# EAGLE design dxlboard (EAGLE 6.1)
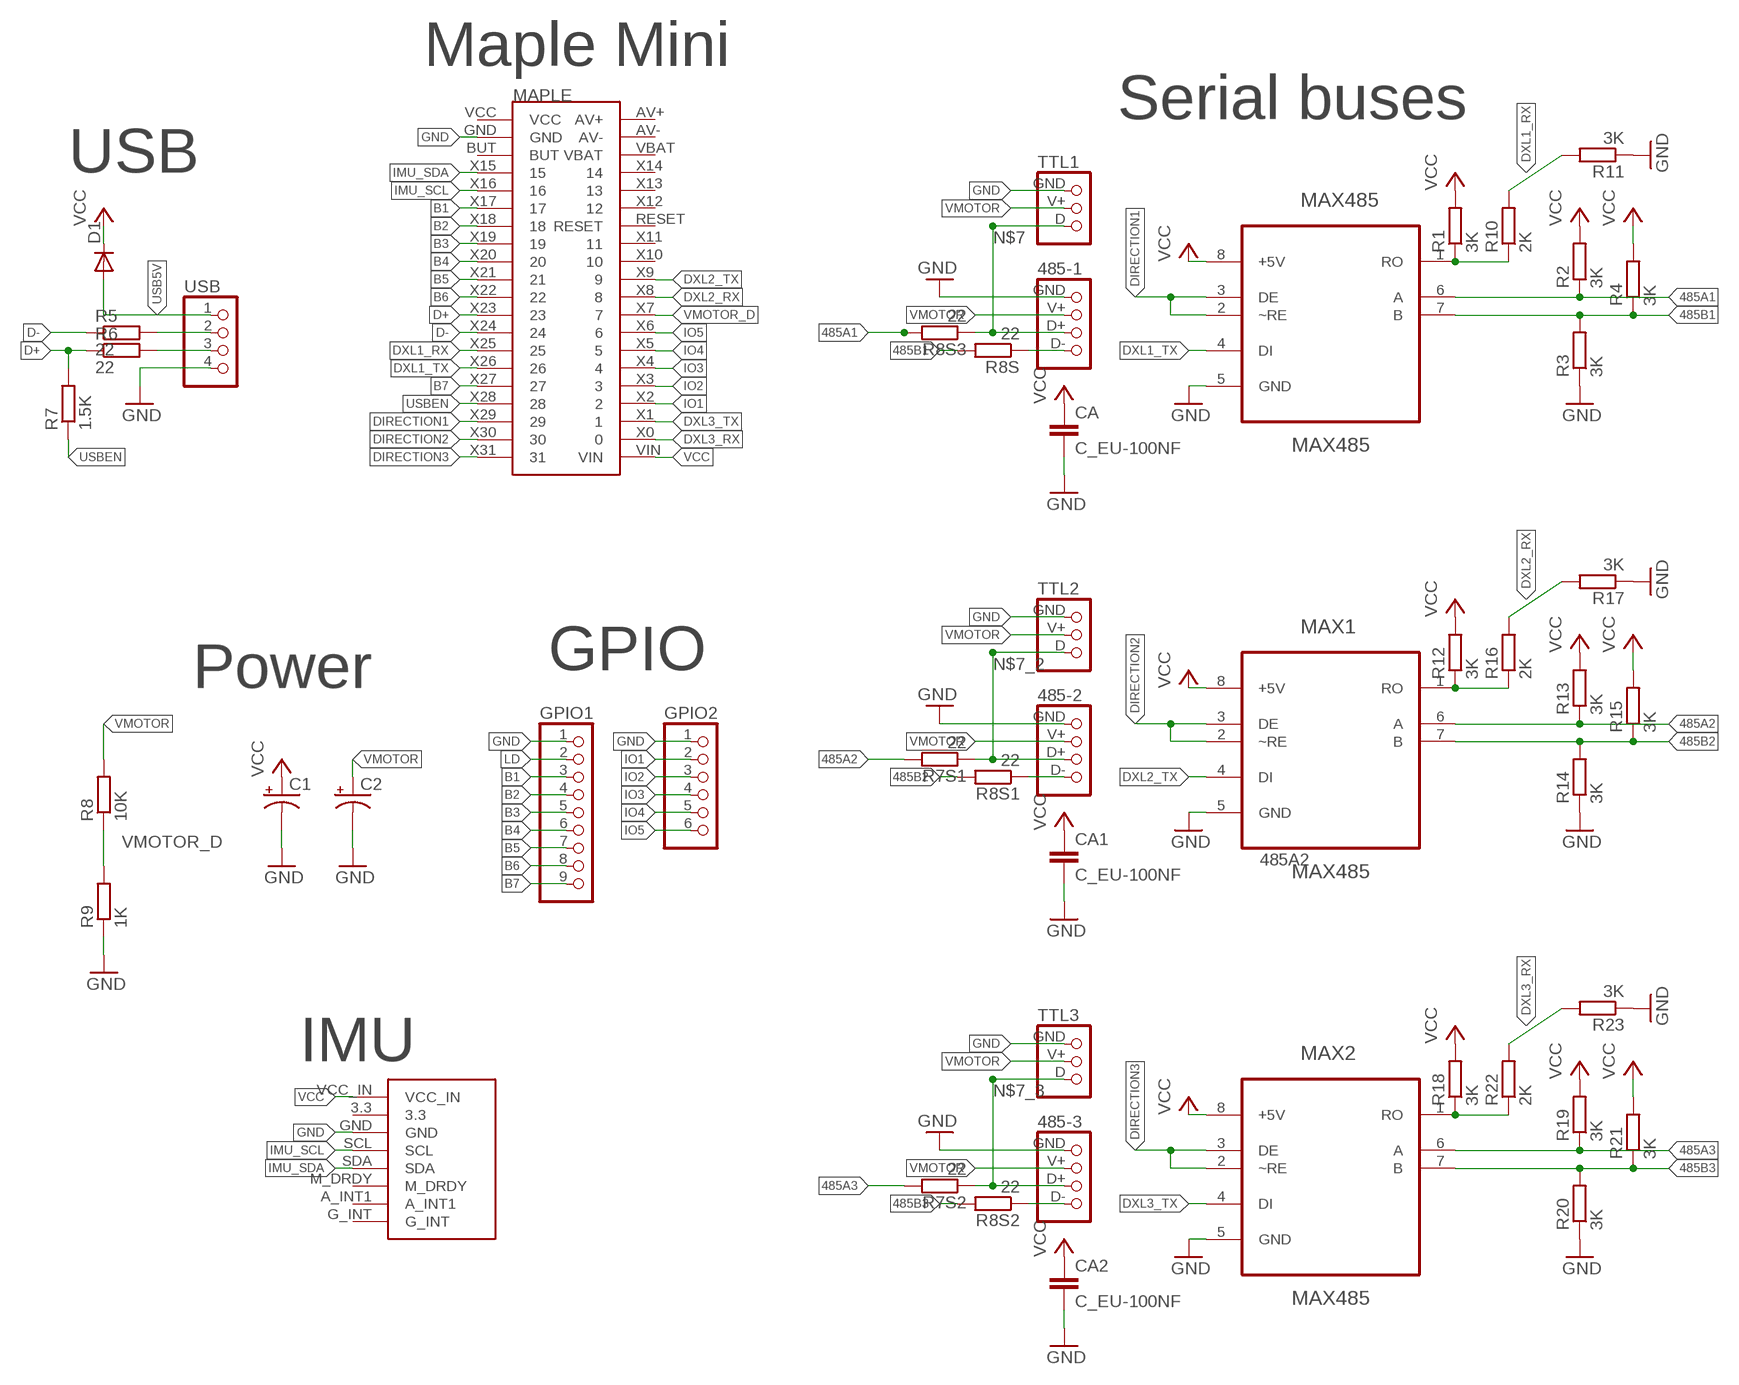
[diagram p0: schematic, sheet 1]

## Parts
485-1  CONNEC_1X04_485  [CONNEC_485]
485-2  CONNEC_1X04_485  [CONNEC_485]
485-3  CONNEC_1X04_485  [CONNEC_485]
C1  CAP_POLPTH2  [CPOL-RADIAL-10UF-25V]
C2  CAP_POLPTH2  [CPOL-RADIAL-10UF-25V]
CA  C_EU-100NF  [C0805]
CA1  C_EU-100NF  [C0805]
CA2  C_EU-100NF  [C0805]
D1  DIODESOD  [SOD-323]
GPIO1  CONNEC_1X09  [CONNEC_1X09]
GPIO2  CONNEC_1X06  [CONNEC_1X06]
MAPLE  MAPLE_MINI  [CONNEC_2X20]
MAX1  MAX485  [SO8]
MAX2  MAX485  [SO8]
MAX485  MAX485  [SO8]
R1  3K  RESISTANCE-R0805  [R0805]
R2  3K  RESISTANCE-R0805  [R0805]
R3  3K  RESISTANCE-R0805  [R0805]
R4  3K  RESISTANCE-R0805  [R0805]
R5  22  RESISTANCE-R0805  [R0805]
R6  22  RESISTANCE-R0805  [R0805]
R7  1.5K  RESISTANCE-R0805  [R0805]
R7S1  22  RESISTANCE-R0805  [R0805]
R7S2  22  RESISTANCE-R0805  [R0805]
R8  10K  RESISTANCE-R0805  [R0805]
R8S  22  RESISTANCE-R0805  [R0805]
R8S1  22  RESISTANCE-R0805  [R0805]
R8S2  22  RESISTANCE-R0805  [R0805]
R8S3  22  RESISTANCE-R0805  [R0805]
R9  1K  RESISTANCE-R0805  [R0805]
R10  2K  RESISTANCE-R0805  [R0805]
R11  3K  RESISTANCE-R0805  [R0805]
R12  3K  RESISTANCE-R0805  [R0805]
R13  3K  RESISTANCE-R0805  [R0805]
R14  3K  RESISTANCE-R0805  [R0805]
R15  3K  RESISTANCE-R0805  [R0805]
R16  2K  RESISTANCE-R0805  [R0805]
R17  3K  RESISTANCE-R0805  [R0805]
R18  3K  RESISTANCE-R0805  [R0805]
R19  3K  RESISTANCE-R0805  [R0805]
R20  3K  RESISTANCE-R0805  [R0805]
R21  3K  RESISTANCE-R0805  [R0805]
R22  2K  RESISTANCE-R0805  [R0805]
R23  3K  RESISTANCE-R0805  [R0805]
TTL1  CONNEC_1X03_TTL  [CONNEC_TTL]
TTL2  CONNEC_1X03_TTL  [CONNEC_TTL]
TTL3  CONNEC_1X03_TTL  [CONNEC_TTL]
U$6  GY-85  [GY-85]
USB  CONNEC_1X04  [CONNEC_1X04]

## Nets
485A1: MAX485.6(A) R2.1 R8S3.2
485A2: MAX1.6(A) R7S1.2 R13.1
485A3: MAX2.6(A) R7S2.2 R19.1
485B1: MAX485.7(B) R3.2 R4.1 R8S.2
485B2: MAX1.7(B) R8S1.2 R14.2 R15.1
485B3: MAX2.7(B) R8S2.2 R20.2 R21.1
B1: GPIO1.3 MAPLE.X17
B2: GPIO1.4 MAPLE.X18
B3: GPIO1.5 MAPLE.X19
B4: GPIO1.6 MAPLE.X20
B5: GPIO1.7 MAPLE.X21
B6: GPIO1.8 MAPLE.X22
B7: GPIO1.9 MAPLE.X27
D+: MAPLE.X23 R6.1 R7.2
D-: MAPLE.X24 R5.1
DIRECTION1: MAPLE.X29 MAX485.2(~RE) MAX485.3(DE)
DIRECTION2: MAPLE.X30 MAX1.2(~RE) MAX1.3(DE)
DIRECTION3: MAPLE.X31 MAX2.2(~RE) MAX2.3(DE)
DXL1_RX: MAPLE.X25 R10.2 R11.2
DXL1_TX: MAPLE.X26 MAX485.4(DI)
DXL2_RX: MAPLE.X8 R16.2 R17.2
DXL2_TX: MAPLE.X9 MAX1.4(DI)
DXL3_RX: MAPLE.X0 R22.2 R23.2
DXL3_TX: MAPLE.X1 MAX2.4(DI)
DXL_1: MAX1.1(RO) R12.1 R16.1
DXL_2: MAX2.1(RO) R18.1 R22.1
DXL_485: MAX485.1(RO) R1.1 R10.1
GND [alime]: 485-1.GND 485-2.GND 485-3.GND C1.2(-) C2.2(-) CA1.2 CA2.2 CA.2 GPIO1.1 GPIO2.1 MAPLE.GND MAX1.5(GND) MAX2.5(GND) MAX485.5(GND) R3.1 R9.1 R11.1 R14.1 R17.1 R20.1 R23.1 TTL1.GND TTL2.GND TTL3.GND U$6.GND USB.4
IMU_SCL: MAPLE.X16 U$6.SCL
IMU_SDA: MAPLE.X15 U$6.SDA
IO1: GPIO2.2 MAPLE.X2
IO2: GPIO2.3 MAPLE.X3
IO3: GPIO2.4 MAPLE.X4
IO4: GPIO2.5 MAPLE.X5
IO5: GPIO2.6 MAPLE.X6
LD: GPIO1.2
N$1: 485-2.D- R8S1.1
N$2: R6.2 USB.3
N$3: 485-3.D- R8S2.1
N$5: 485-1.D- R8S.1
N$6: R5.2 USB.2
N$7: 485-1.D+ R8S3.1 TTL1.D
N$7_2: 485-2.D+ R7S1.1 TTL2.D
N$7_3: 485-3.D+ R7S2.1 TTL3.D
USB5V: D1.2(A) USB.1
USBEN: MAPLE.X28 R7.1
VCC: C1.1(+) CA1.1 CA2.1 CA.1 D1.1(C) MAPLE.VIN MAX1.8(+5V) MAX2.8(+5V) MAX485.8(+5V) R1.2 R2.2 R4.2 R12.2 R13.2 R15.2 R18.2 R19.2 R21.2 U$6.VCC_IN
VMOTOR [alime]: 485-1.V+ 485-2.V+ 485-3.V+ C2.1(+) R8.2 TTL1.V+ TTL2.V+ TTL3.V+
VMOTOR_D: MAPLE.X7 R8.1 R9.2
Unconnected: MAPLE.AV+ MAPLE.AV- MAPLE.BUT MAPLE.RESET MAPLE.VBAT MAPLE.VCC MAPLE.X10 MAPLE.X11 MAPLE.X12 MAPLE.X13 MAPLE.X14 U$6.3.3 U$6.A_INT1 U$6.G_INT U$6.M_DRDY

## Notes on the sheet
- Maple Mini
- Serial buses
- USB
- Power | GPIO
- IMU

## Library data of the parts
485-1-485-3 = rhoban:CONNEC_1X04; FARNELL: 1104204
C1 C2 = SparkFun-Passives:CAP_POL: Capacitor Polarized These are standard SMD and PTH capacitors. Normally 10uF, 47uF, and 100uF in electrolytic and tantalum varieties. Always verify the external diameter of the through hole cap, it varies with capacity, voltage, and manufacturer. The EIA devices should be standard.; FARNELL: 1144619
CA CA1 CA2 = rhoban:C_EU: non polarised condo; DATASHEET: condo100nF.pdf; FARNELL: 2688486RL; FARNELL_LINK: http://fr.farnell.com/kemet/c0805c104j5ractu/condensateur-100nf-50v-x7r-0805/dp/1414663RL
D1 = SparkFun-DiscreteSemi:DIODE: Diode These are standard reverse protection diodes and small signal diodes. SMA package can handle up to about 1A. SOD-323 can handle about 200mA. What the SOD-323 package when ordering, there are some mfgs out there that are 5-pin packages.; FARNELL: 8737843RL
GPIO1 = rhoban:CONNEC_1X09; FARNELL: -
GPIO2 = rhoban:CONNEC_1X06; FARNELL: -
MAPLE = rhoban:MAPLE_MINI; FARNELL: 1593469,1593469
MAX1 MAX2 MAX485 = rhoban:MAX485; DATASHEET: max485.pdf; DESCRIPTION: ±15kV ESD-Protected, Slew-Rate-Limited, Low-Power, RS-485/RS-422 Transceivers; FARNELL: 1564306; FARNELL_LINK: http://fr.farnell.com/maxim-integrated-products/max485eesa/transceiver-rs-485-422-cms/dp/1379973?Ntt=1379973; MPN: MAX485EESA+; OC_FARNELL: 1379973; OC_NEWARK: 68K4798; PACKAGE: SOIC-8; SUPPLIER: Maxim
R1-R4 R11-R15 R17-R21 R23 = rhoban:RESISTANCE: RESISTOR, European symbol; FARNELL: 2074431
R5 R6 R7S1 R7S2 R8S R8S1-R8S3 = rhoban:RESISTANCE: RESISTOR, European symbol; FARNELL: 2446926
R7 = rhoban:RESISTANCE: RESISTOR, European symbol; FARNELL: 2447592
R8 = rhoban:RESISTANCE: RESISTOR, European symbol; FARNELL: 2074334RL
R9 = rhoban:RESISTANCE: RESISTOR, European symbol; FARNELL: 2074332RL
R10 R16 R22 = rhoban:RESISTANCE: RESISTOR, European symbol; FARNELL: 2447622
TTL1-TTL3 = rhoban:CONNEC_1X03; FARNELL: 9979620
U$6 = rhoban:GY-85; FARNELL: 1593463
USB = rhoban:CONNEC_1X04; FARNELL: -

## Net classes
1 alime: width 0.762 mm, drill 0.254 mm

## Board
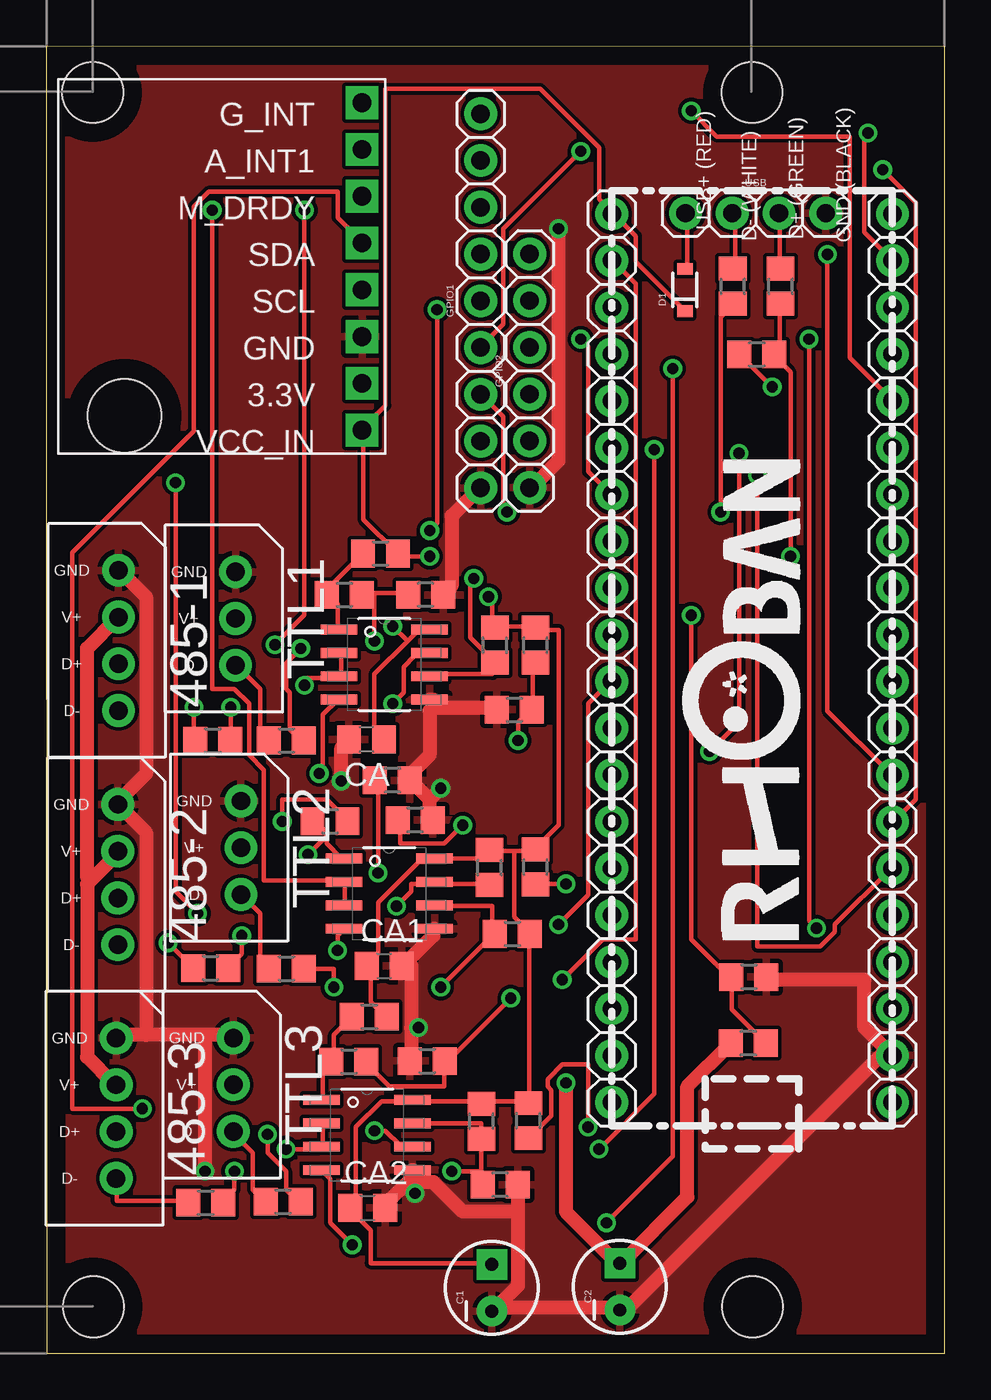
[diagram p1: board, top side]
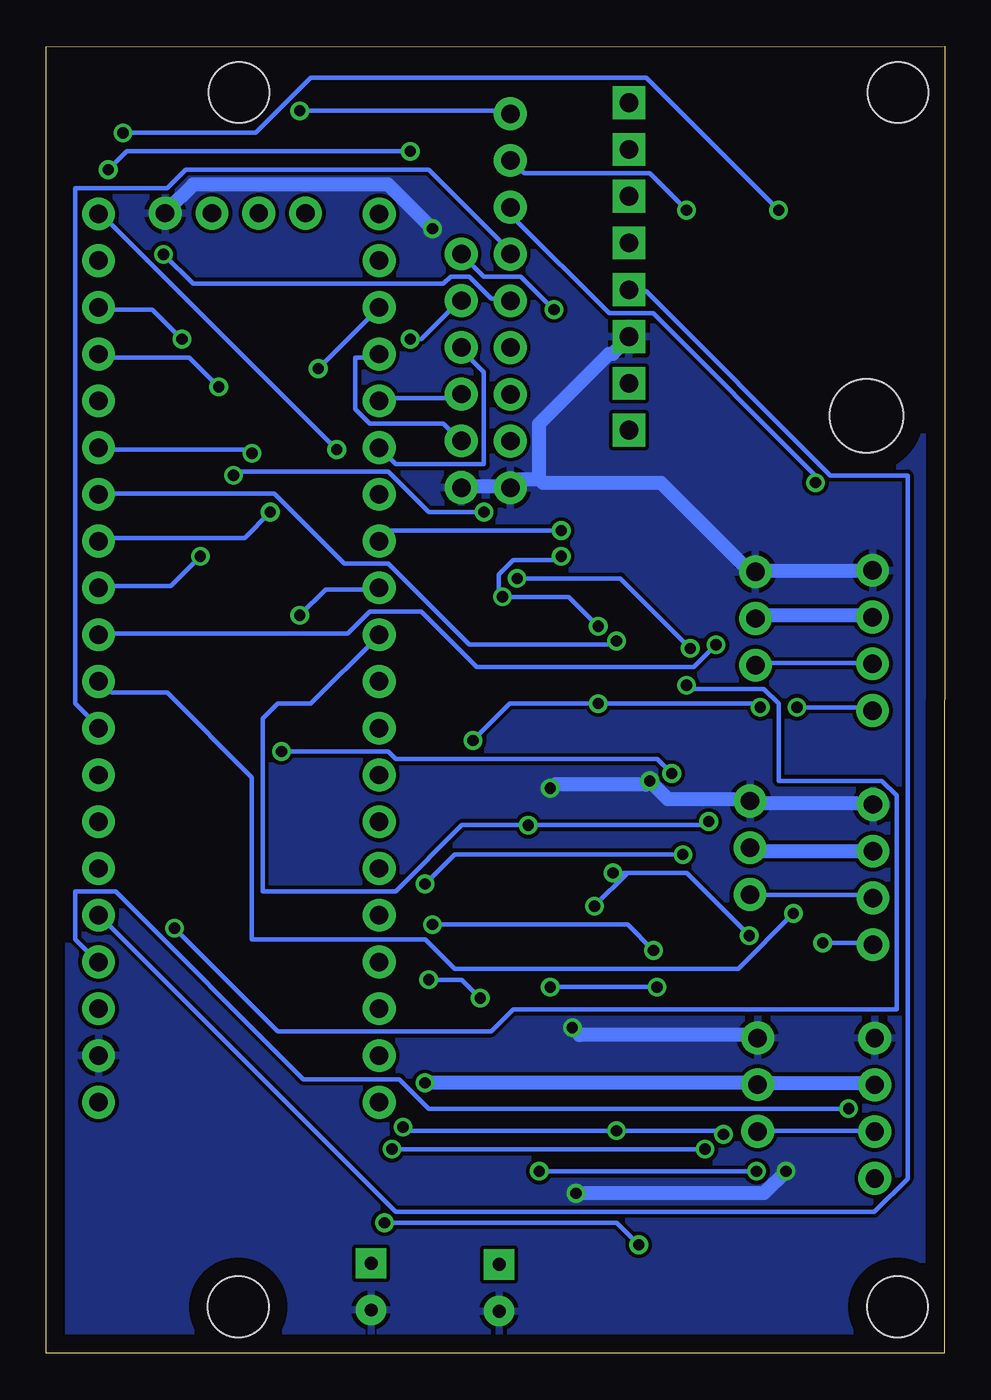
[diagram p2: board, bottom side, seen from below]

Size 48.81 x 71.02 mm. Coordinates in mm from the lower left corner, seen from the top.
Outline: 0.03,0 48.8,0 48.81,70.99 0,71.02 0.03,0
Copper layers (1*16): Top 0.035mm / dielectric 1.5mm / Bottom 0.035mm
Design rules: minimum track width 10mil, minimum drill 24mil, track to track 8mil, track to pad 8mil, pad to pad 8mil, via to via 8mil, smd to smd 8mil, copper to edge 40mil, drill to drill 8mil, minimum pad ring 8mil, minimum via ring 8mil, stop-mask expansion 4mil, vias tented up to drill 0mil, thermal gap 10mil

### Footprints (pad centres in the part's own frame; a part is rotated, then mirrored left to right if it is on the bottom)
CONNEC_485 = drill 1 pad 1.778: D+ 7.62,3.81; D- 10.16,3.81; GND 2.54,3.81; V+ 5.08,3.81
CPOL-RADIAL-10UF-25V = drill 0.7 pad 1.651 square: 1 1.27,0 | drill 0.7 pad 1.651: 2 -1.27,0
C0805 = smd 1.3 x 1.5: 1 -0.95,0; 2 0.95,0
SOD-323 = smd 0.63 x 0.83: 1 -1.15,0; 2 1.15,0
CONNEC_1X09 = drill 1 pad 1.778: 1 -1.27,1.27; 2 1.27,1.27; 3 3.81,1.27; 4 6.35,1.27; 5 8.89,1.27; 6 11.43,1.27; 7 13.97,1.27; 8 16.51,1.27; 9 19.05,1.27
CONNEC_1X06 = drill 1 pad 1.778: 1 -1.27,1.27; 2 1.27,1.27; 3 3.81,1.27; 4 6.35,1.27; 5 8.89,1.27; 6 11.43,1.27
CONNEC_2X20 = drill 1 pad 1.778: AV+ 0,0; AV- 2.54,0; BUT 5.08,-15.24; GND 2.54,-15.24; RESET 15.24,0; VBAT 5.08,0; VCC 0,-15.24; VIN 48.26,0; X0 45.72,0; X1 43.18,0; X2 40.64,0; X3 38.1,0; X4 35.56,0; X5 33.02,0; X6 30.48,0; X7 27.94,0; X8 25.4,0; X9 22.86,0; X10 20.32,0; X11 17.78,0; X12 12.7,0; X13 10.16,0; X14 7.62,0; X15 7.62,-15.24; X16 10.16,-15.24; X17 12.7,-15.24; X18 15.24,-15.24; X19 17.78,-15.24; X20 20.32,-15.24; X21 22.86,-15.24; X22 25.4,-15.24; X23 27.94,-15.24; X24 30.48,-15.24; X25 33.02,-15.24; X26 35.56,-15.24; X27 38.1,-15.24; X28 40.64,-15.24; X29 43.18,-15.24; X30 45.72,-15.24; X31 48.26,-15.24
SO8 = smd 1.981 x 0.533: 1 -2.464,1.905; 2 -2.464,0.635; 3 -2.464,-0.635; 4 -2.464,-1.905; 5 2.464,-1.905; 6 2.464,-0.635; 7 2.464,0.635; 8 2.464,1.905
R0805 = smd 1.3 x 1.5: 1 -0.95,0; 2 0.95,0
CONNEC_TTL = drill 1 pad 1.778: D 7.62,3.81; GND 2.54,3.81; V+ 5.08,3.81
STAND-OFF = hole 3.302: 0,0
GY-85 = drill 1.016 pad 1.778 square: 3.3 0,15.24; A_INT1 0,2.54; G_INT 0,0; GND 0,12.7; M_DRDY 0,5.08; SCL 0,10.16; SDA 0,7.62; VCC_IN 0,17.78 | hole 4: 12.9,17
CONNEC_1X04 = drill 1 pad 1.778: 1 -1.27,1.27; 2 1.27,1.27; 3 3.81,1.27; 4 6.35,1.27

### Placement (x,y rotation side)
485-1  0.12,45.08 270 top
485-2  0.09,32.36 270 top
485-3  0,19.67 270 top
C1  24.21,3.57 90 top
C2  31.16,3.63 90 top
CA  17.4,33.35 180 top
CA1  18.36,21.05 0 top
CA2  17.46,7.91 0 top
D1  34.69,57.77 90 top
GPIO1  24.87,48.29 90 top
GPIO2  27.53,48.3 90 top
MAPLE  30.72,13.64 90 top
MAX1  18.63,24.98 0 top
MAX2  17.43,11.87 0 top
MAX485  18.37,37.42 0 top
R1  18.16,43.45 0 top
R2  24.37,38.48 90 top
R3  25.43,34.97 0 top
R4  26.58,38.48 90 top
R5  37.29,57.97 90 top
R6  39.89,57.97 90 top
R7  38.59,54.27 0 top
R7S1  13.05,20.91 0 top
R7S2  12.87,8.25 0 top
R8  38.13,16.85 180 top
R8S  9.05,33.29 0 top
R8S1  8.94,20.94 0 top
R8S2  8.67,8.19 0 top
R8S3  13.05,33.3 0 top
R9  38.16,20.45 180 top
R10  16.2,41.21 0 top
R11  20.61,41.21 180 top
R12  26.58,26.42 90 top
R13  25.32,22.79 0 top
R14  18.81,31.13 180 top
R15  24.09,26.39 90 top
R16  15.42,28.91 0 top
R17  20.04,28.97 180 top
R18  17.55,18.29 0 top
R19  26.19,12.65 90 top
R20  24.66,9.17 180 top
R21  23.64,12.62 90 top
R22  16.44,15.86 0 top
R23  20.7,15.89 0 top
TTL1  6.48,45 270 top
TTL2  6.77,32.55 270 top
TTL3  6.36,19.68 270 top
U$2  [STAND-OFF]  2.57,2.54 0 top
U$3  [STAND-OFF]  38.37,2.54 0 top
U$4  [STAND-OFF]  38.34,68.49 0 top
U$5  [STAND-OFF]  2.54,68.49 0 top
U$6  17.16,67.94 180 top
USB  35.99,60.67 0 top

### Tracks (layer width: path | path; a pad name or v marks a point on that pad's centre or on a via)
485A1  (via drill 0.61)
  Top 0.254: v13.83,38.3 13.03,37.5 13.03,36.1 13.23,35.9 13.23,33.9 13.83,33.3 R8S3.2 | v23.23,42.1 23.03,41.9 23.03,38.9 24.23,37.7 R2.1 24.23,37.5 24.23,36.9 21.03,36.9 MAX485.6
  Bottom 0.254: v13.83,38.3 17.63,42.1 v23.23,42.1
485A2  (via drill 0.61)
  Top 0.254: v15.63,19.9 15.63,20.9 14.03,20.9 R7S1.2 | v21.43,19.9 24.23,22.7 R13.1 24.23,22.9 24.23,24.3 21.23,24.3 MAX1.6
  Bottom 0.254: v21.43,19.9 v15.63,19.9
485A3  (via drill 0.61)
  Top 0.254: v12.03,11.9 12.03,10.9 13.03,9.9 13.03,8.9 13.63,8.3 R7S2.2 | v17.83,12.1 18.43,12.1 19.23,11.3 19.83,11.3 MAX2.6 | v29.43,12.3 29.43,15.7 28.03,15.7 27.23,14.9 27.23,14.5 27.43,14.3 27.43,12.9 26.23,11.7 R19.1
  Bottom 0.254: v12.03,11.9 12.23,12.1 v17.83,12.1 29.23,12.1 v29.43,12.3
485B1  (via drill 0.61)
  Top 0.254: R4.1 26.43,37.5 26.43,35.1 R3.2 26.23,34.9 25.63,34.3 v25.63,33.3 | v10.03,35.1 10.03,33.3 R8S.2 | v18.83,35.3 19.43,35.9 19.43,37.3 20.03,37.9 20.83,37.9 MAX485.7
  Bottom 0.254: v10.03,35.1 10.23,35.3 v18.83,35.3 23.63,35.3 v25.63,33.3
485B2  (via drill 0.61)
  Top 0.254: R15.1 24.03,25.5 21.23,25.5 MAX1.7 21.03,25.5 19.83,25.5 19.83,25.1 v19.03,24.3 | v10.63,22.7 10.63,21.7 10.03,21.1 R8S1.2 | v18.03,26.1 18.03,31.1 R14.2
  Bottom 0.254: v10.63,22.7 14.03,26.1 17.23,26.1 | v18.03,26.1 17.23,26.1 | 17.23,26.1 v19.03,24.3
485B3  (via drill 0.61)
  Top 0.254: v10.23,9.9 10.23,8.9 9.63,8.3 R8S2.2 | 23.63,9.9 v22.03,9.9 | 23.63,9.9 23.63,9.3 R20.2 23.63,9.9 | 23.63,9.9 23.63,11.5 R21.1 23.63,11.7 23.63,12.5 20.03,12.5 MAX2.7
  Bottom 0.254: v22.03,9.9 v10.23,9.9
B1  (via drill 0.61)
  Top 0.254: v38.63,47.7 38.63,22.1 42.03,22.1 42.83,22.9 42.83,23.3 45.83,26.3 MAPLE.X17 | v25.03,45.7 24.83,45.9 24.83,50.9 23.63,52.1 GPIO1.3
  Bottom 0.254: v38.63,47.7 38.43,47.9 30.23,47.9 28.03,45.7 v25.03,45.7
B2  (via drill 0.61)
  Top 0.254: v45.43,64.3 47.23,62.5 47.23,30.1 46.03,28.9 MAPLE.X18 | v29.03,65.3 24.83,61.1 24.83,55.9 23.63,54.7 GPIO1.4
  Bottom 0.254: v45.43,64.3 44.43,65.3 v29.03,65.3
B3  (via drill 0.61)
  Top 0.254: v42.43,59.7 42.43,34.9 45.83,31.5 MAPLE.X19
  Bottom 0.254: v42.43,59.7 40.83,58.1 27.23,58.1 26.83,58.5 25.83,58.5 24.63,57.3 23.63,57.3 GPIO1.5
B4
  Bottom 0.254: MAPLE.X20 46.03,34.1 47.23,35.3 47.23,63.3 42.23,63.3 41.23,64.3 28.03,64.3 23.63,59.9 GPIO1.6
B5  (via drill 0.61)
  Top 0.254: v8.23,23.9 7.03,25.1 v7.03,47.3
  Bottom 0.254: v8.23,23.9 11.23,20.9 26.63,20.9 28.23,22.5 37.63,22.5 37.63,31.3 42.23,35.9 45.23,35.9 45.83,36.5 MAPLE.X21 | v7.03,47.3 7.03,47.7 15.83,56.5 18.23,56.5 23.43,61.7 23.43,62.1 GPIO1.7
B6  (via drill 0.61)
  Top 0.254: v12.43,38.5 14.03,40.1 v14.03,62.1
  Bottom 0.254: v12.43,38.5 13.63,37.3 25.43,37.3 28.43,40.3 31.23,40.3 32.43,39.1 45.83,39.1 MAPLE.X22 | v14.03,62.1 16.03,64.1 22.83,64.1 23.43,64.7 GPIO1.8
B7  (via drill 0.61)
  Top 0.254: v35.03,67.5 36.43,66.1 43.63,66.1 43.63,54.1 45.83,51.9 MAPLE.X27
  Bottom 0.254: v35.03,67.5 23.63,67.5 GPIO1.9
D+  (via drill 0.61)
  Top 0.254: R6.1 39.83,56.9 39.83,54.5 39.63,54.3 R7.2 39.63,54.1 40.43,53.3 v40.43,43.3
  Bottom 0.254: v40.43,43.3 42.03,41.7 45.83,41.7 MAPLE.X23
D-  (via drill 0.61)
  Top 0.254: v36.63,45.7 36.63,56.3 37.23,56.9 R5.1
  Bottom 0.254: v36.63,45.7 38.03,44.3 45.83,44.3 MAPLE.X24
DIRECTION1  (via drill 0.61)
  Top 0.254: MAX485.2 16.03,37.9 16.03,36.9 MAX485.3 15.83,36.7 14.03,36.7 v14.03,36.3 | v41.83,23.1 41.43,23.5 v41.43,55.1
  Bottom 0.254: v14.03,36.3 13.83,36.1 9.83,36.1 9.03,35.3 9.03,31.1 3.43,31.1 2.63,30.3 2.63,18.7 23.43,18.7 24.63,17.5 36.23,17.5 v41.83,23.1 | v41.43,55.1 43.03,56.7 45.83,56.7 MAPLE.X29
DIRECTION2  (via drill 0.61)
  Top 0.254: MAX1.3 16.23,24.5 16.23,25.5 MAX1.2 16.03,25.7 11.83,25.7 11.83,31.7 11.03,32.5 11.03,35.3 10.23,36.1 9.03,36.1 v9.03,62.1 | v44.63,66.3 44.43,66.1 44.43,60.9 45.83,59.5 MAPLE.X30
  Bottom 0.254: v9.03,62.1 16.23,69.3 34.43,69.3 37.43,66.3 v44.63,66.3
DIRECTION3  (via drill 0.61)
  Top 0.254: MAX2.2 15.03,12.5 15.03,11.3 MAX2.3 14.83,11.1 v13.03,11.1 | v30.03,11.1 33.03,14.1 v33.03,49.1
  Bottom 0.254: v30.03,11.1 v13.03,11.1 | v33.03,49.1 45.83,61.9 MAPLE.X31
DXL1_RX  (via drill 0.61)
  Top 0.254: 17.83,41.3 19.63,41.3 R11.2 | 17.83,41.3 17.23,41.3 R10.2 | v17.83,38.7 17.83,41.3
  Bottom 0.254: v17.83,38.7 18.03,38.5 25.83,38.5 30.23,42.9 32.63,42.9 36.43,46.7 45.83,46.7 MAPLE.X25
DXL1_TX  (via drill 0.61)
  Top 0.254: v14.83,31.5 15.03,31.7 15.03,34.7 15.83,35.5 MAX485.4 | v36.03,32.7 37.63,34.3 v37.63,48.9
  Bottom 0.254: v14.83,31.5 15.63,32.3 29.83,32.3 30.23,32.7 v36.03,32.7 | v37.63,48.9 37.83,49.1 45.83,49.1 MAPLE.X26
DXL2_RX  (via drill 0.61)
  Top 0.254: v12.83,28.9 12.83,30.1 15.23,30.1 16.23,29.1 R16.2 | v22.63,28.7 21.63,27.7 19.23,27.7 19.23,28.9 R17.2
  Bottom 0.254: v12.83,28.9 13.03,28.7 v22.63,28.7 26.23,28.7 29.83,25.1 37.03,25.1 37.03,34.5 36.23,35.3 34.43,35.3 30.83,38.9 MAPLE.X8
DXL2_TX  (via drill 0.61)
  Top 0.254: v15.83,21.9 15.83,22.7 16.03,22.9 MAX1.4 | v27.83,23.3 29.43,24.9 29.43,35.3 30.63,36.5 MAPLE.X9
  Bottom 0.254: v15.83,21.9 17.23,23.3 v27.83,23.3
DXL3_RX  (via drill 0.61)
  Top 0.254: R22.2 17.43,15.7 18.63,14.5 21.63,14.5 21.63,15.7 R23.2 21.83,15.9 v25.23,19.3 | v28.03,20.3 30.23,22.5 32.03,22.5 32.03,58.1 30.83,59.3 MAPLE.X0
  Bottom 0.254: v25.23,19.3 26.23,20.3 v28.03,20.3
DXL3_TX  (via drill 0.61)
  Top 0.254: v16.63,5.9 15.43,7.1 15.43,9.5 15.03,9.9 MAX2.4 | v30.43,7.1 34.03,10.7 v34.03,53.5
  Bottom 0.254: v16.63,5.9 17.83,7.1 v30.43,7.1 | v34.03,53.5 30.83,56.7 MAPLE.X1
DXL_1  (via drill 0.61)
  Top 0.254: 15.23,28.1 15.23,27.7 16.03,26.9 MAX1.1 | 15.23,28.1 15.23,28.3 14.63,28.9 R16.1 | v28.23,25.5 26.63,25.5 R12.1 | 15.23,28.1 v14.23,27.1
  Bottom 0.254: v28.23,25.5 26.63,27.1 v14.23,27.1
DXL_2
  Top 0.254: MAX2.1 15.03,13.9 15.03,15.3 15.43,15.7 R22.1 15.63,15.9 15.63,17.3 16.43,18.1 R18.1
DXL_485
  Top 0.254: MAX485.1 15.83,39.5 15.83,40.7 15.43,41.1 R10.1 15.43,41.3 15.43,41.7 17.03,43.3 R1.1
GND  (via drill 0.61)
  Top 0.762: R9.1 39.23,20.3 44.43,20.3 44.43,17.7 45.83,16.3 MAPLE.GND 45.43,16.3 31.43,2.3 C2.2 31.03,2.5 24.83,2.5 C1.2 24.23,2.3 25.63,3.7 25.63,7.7 | 19.83,9.5 18.43,8.1 CA2.2 | 19.83,9.5 19.83,9.9 MAX2.5 | 25.63,7.7 25.63,9.1 R20.1 | 20.03,9.3 21.03,9.3 22.63,7.7 25.63,7.7 | 20.03,9.3 19.83,9.5 | MAX1.5 21.03,22.9 21.03,22.7 19.43,21.1 CA1.2 19.83,21.1 19.83,17.7 | 19.83,17.7 19.83,15.9 R23.1 | 8.63,17.3 10.03,17.3 TTL3.GND | 8.63,17.3 5.43,17.3 | 5.43,17.3 3.83,17.3 485-3.GND | v20.23,17.7 19.83,17.7 | 20.83,30.1 19.83,31.1 R14.1 19.83,31.5 20.83,32.5 20.83,34.9 21.03,35.1 | 20.83,30.1 20.83,29.1 R17.1 | 21.03,35.1 24.43,35.1 R3.1 | 21.03,35.1 21.03,35.5 MAX485.5 | v16.03,31.1 16.03,32.9 16.43,33.3 CA.2 | v21.43,30.7 20.83,30.1 | 5.43,17.3 5.43,28.3 4.03,29.7 485-2.GND 4.03,30.1 5.43,31.5 5.43,41.1 4.03,42.5 485-1.GND | R11.1 21.63,41.3 22.03,41.7 22.03,45.5 23.43,46.9 GPIO1.1 | v27.83,61.1 27.83,48.5 26.43,47.1 GPIO2.1 | v20.03,8.7 20.03,9.3 | 8.63,17.3 v8.63,9.9
  Bottom 0.762: v20.23,17.7 19.83,17.3 10.23,17.3 TTL3.GND | 485-2.GND 4.03,29.9 10.23,29.9 TTL2.GND 10.63,30.1 15.03,30.1 v16.03,31.1 16.23,30.9 21.23,30.9 v21.43,30.7 | 485-1.GND 4.03,42.5 10.23,42.5 TTL1.GND 10.63,42.5 15.43,47.3 21.83,47.3 22.03,47.5 | GPIO2.1 26.23,47.1 23.63,47.1 GPIO1.1 23.63,47.5 22.03,47.5 | 22.03,47.5 22.03,50.5 18.23,54.3 18.03,54.3 17.23,55.1 U$6.GND | v27.83,61.1 30.23,63.5 40.83,63.5 42.23,62.1 USB.4 | v20.03,8.7 9.83,8.7 v8.63,9.9
  pour Top: -8.47,84.3 67.03,84.3 67.03,-26.2 -18.97,-26.2 -12.47,49.3
  pour Bottom: -14.97,79.3 61.03,79.3 61.03,-9.7 -33.97,-9.7
IMU_SCL
  Bottom 0.254: MAPLE.X16 45.83,23.7 29.83,7.7 3.83,7.7 2.03,9.5 2.03,47.7 6.23,47.7 16.23,57.7 17.03,57.7 U$6.SCL
IMU_SDA  (via drill 0.61)
  Top 0.254: v5.23,13.3 1.43,13.3 1.43,43.5 8.03,50.1 8.03,62.3 8.83,63.1 15.83,63.1 15.83,61.7 17.03,60.5 U$6.SDA
  Bottom 0.254: v5.23,13.3 28.03,13.3 29.63,14.9 34.83,14.9 45.03,25.1 47.23,25.1 47.23,22.5 46.03,21.3 MAPLE.X15
IO1
  Bottom 0.254: GPIO2.2 26.43,49.7 27.23,50.5 31.23,50.5 32.03,51.3 32.03,54.1 30.83,54.1 MAPLE.X2
IO2
  Bottom 0.254: GPIO2.3 26.43,52.1 26.63,51.9 30.63,51.9 MAPLE.X3
IO3
  Bottom 0.254: GPIO2.4 26.23,54.5 25.03,53.3 25.03,48.3 29.83,48.3 30.63,49.1 MAPLE.X4
IO4  (via drill 0.61)
  Top 0.254: v29.03,55.1 29.43,54.7 29.43,47.9 30.63,46.7 MAPLE.X5
  Bottom 0.254: v29.03,55.1 28.43,55.1 26.43,57.1 GPIO2.5
IO5  (via drill 0.61)
  Top 0.254: v20.83,44.7 21.23,45.1 v21.23,56.7
  Bottom 0.254: v20.83,44.7 30.23,44.7 30.63,44.3 MAPLE.X6 | v21.23,56.7 23.03,58.5 25.03,58.5 GPIO2.6
N$1  (via drill 0.61)
  Top 0.254: v6.63,22.3 R8S1.1
  Bottom 0.254: v6.63,22.3 4.03,22.3 485-2.D-
N$2
  Top 0.254: R6.2 39.83,59.1 39.83,61.9 USB.3
N$3
  Top 0.254: R8S2.1 7.63,8.3 3.83,8.3 3.83,9.5 485-3.D-
N$5  (via drill 0.61)
  Top 0.254: v8.03,35.1 8.03,33.3 R8S.1
  Bottom 0.254: v8.03,35.1 4.03,35.1 485-1.D-
N$6
  Top 0.254: R5.2 37.43,59.1 37.43,61.9 USB.2
N$7
  Top 0.254: R8S3.1 12.03,33.3 11.63,33.7 11.63,36.1 10.43,37.3 TTL1.D
  Bottom 0.254: 485-1.D+ 4.03,37.5 10.23,37.5 TTL1.D
N$7_2
  Top 0.254: R7S1.1 12.03,21.1 11.63,21.5 11.63,23.9 10.63,24.9 TTL2.D
  Bottom 0.254: 485-2.D+ 4.03,24.9 10.43,24.9 TTL2.D
N$7_3
  Top 0.254: R7S2.1 11.83,8.3 11.23,8.9 11.23,10.9 10.23,11.9 TTL3.D
  Bottom 0.254: 485-3.D+ 3.83,12.1 10.03,12.1 TTL3.D
USB5V
  Top 0.254: D1.2 34.83,59.1 34.83,61.9 USB.1
USBEN  (via drill 0.61)
  Top 0.254: v39.43,52.5 37.83,54.1 R7.1
  Bottom 0.254: v39.43,52.5 41.03,54.1 45.83,54.1 MAPLE.X28
VCC  (via drill 0.61)
  Top 0.254: D1.1 34.63,56.7 32.03,59.3 32.03,60.7 30.83,61.9 MAPLE.VIN 30.63,62.1 30.03,62.7 30.03,65.5 26.83,68.7 18.43,68.7 18.43,51.5 17.23,50.3 U$6.VCC_IN 17.23,50.1 17.23,45.3 19.03,43.5 R1.2 19.23,43.3 v20.83,43.3 | C1.1 24.03,4.9 17.63,4.9 17.63,6.7 16.63,7.7 16.63,7.9 CA2.1 16.63,8.1 16.83,8.3 16.83,12.3 18.23,13.7 19.83,13.7 MAX2.8 20.03,13.7 23.63,13.7 R21.2 23.83,13.7 26.03,13.7 R19.2 26.23,13.7 26.23,22.7 R13.2 26.23,22.9 25.43,23.7 25.43,27.3 | 19.63,38.7 20.23,39.3 20.83,39.3 MAX485.8 | 19.63,38.7 17.83,36.9 17.83,33.9 18.23,33.5 CA.1 | R18.2 18.43,18.3 17.63,19.1 17.63,20.7 17.43,20.9 CA1.1 17.43,21.1 18.03,21.7 18.03,24.5 20.23,26.7 21.03,26.7 MAX1.8 21.23,26.9 24.03,26.9 24.03,27.3 R15.2 24.23,27.3 25.43,27.3 | 25.43,27.3 26.43,27.3 R12.2 26.63,27.5 27.83,28.7 27.83,39.3 26.63,39.3 R4.2 26.43,39.5 24.43,39.5 R2.2 24.23,39.5 24.23,40.9 v24.03,41.1 | v18.83,39.5 19.63,38.7
  Bottom 0.254: v18.83,39.5 20.43,41.1 v24.03,41.1 24.23,41.1 24.23,42.3 23.43,43.1 21.03,43.1 v20.83,43.3
VMOTOR  (via drill 0.61)
  Top 0.762: R8.2 34.83,14.5 34.83,8.5 31.23,4.9 C2.1 30.83,5.1 28.23,7.7 v28.23,14.7 | 2.43,25.7 3.83,27.1 485-2.V+ | 2.43,25.7 2.23,25.5 2.23,16.1 3.63,14.7 485-3.V+ | 485-1.V+ 2.23,38.3 2.23,25.9 2.43,25.7
  Bottom 0.762: 485-1.V+ 4.03,40.1 10.23,40.1 TTL1.V+ | 485-3.V+ 3.83,14.7 10.03,14.7 TTL3.V+ 10.43,14.7 v28.23,14.7 | 485-2.V+ 4.03,27.3 10.43,27.3 TTL2.V+
VMOTOR_D  (via drill 0.61)
  Top 0.254: R8.1 37.23,18.7 37.23,20.3 R9.2 37.03,20.5 35.03,22.5 v35.03,40.1
  Bottom 0.254: v35.03,40.1 33.63,41.5 30.83,41.5 MAPLE.X7

### Text on the board
_tsilk: USB+ (RED) | D- (WHITE) | D+ (GREEN) | GND (BLACK)